# EAGLE design bmx160 (EAGLE 9.6.2)
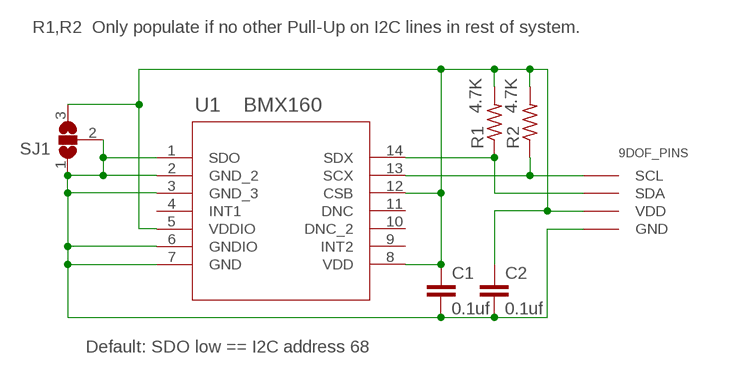
[diagram p0: schematic, sheet 1]

## Parts
C1  0.1uf  C-EUC0603K  [C0603K]
C2  0.1uf  C-EUC0603K  [C0603K]
MOD1  9DOF_PINS  [9DOF_PINS]
R1  4.7K  R-US_M0805  [M0805]
R2  4.7K  R-US_M0805  [M0805]
SJ1  SJ2W  [SJ_2]
U1  BMX160  BMX160BMX160_BOS-M  [BMX160_BOS-M]

## Nets
GND: C1.2 C2.2 MOD1.GND SJ1.1 SJ1.2 U1.1(SDO) U1.2(GND_2) U1.3(GND_3) U1.6(GNDIO) U1.7(GND)
N$3: MOD1.SDA R1.1 U1.14(SDX)
N$4: MOD1.SCL R2.1 U1.13(SCX)
VDD: C1.1 C2.1 MOD1.VDD R1.2 R2.2 SJ1.3 U1.5(VDDIO) U1.8(VDD) U1.12(CSB)
Unconnected: U1.4(INT1) U1.9(INT2) U1.10(DNC_2) U1.11(DNC)

## Notes on the sheet
- R1,R2  Only populate if no other Pull-Up on I2C lines in rest of system.
- Default: SDO low == I2C address 68

## Library data of the parts
C1 C2 = rcl:C-EU: CAPACITOR, European symbol; SPICEPREFIX: C
MOD1 = bmx160:9DOF_PINS: Sparkfun part no: SEN-13944, Accel,Rate,Magnetometer
R1 R2 = rcl:R-US_: RESISTOR, American symbol; SPICEPREFIX: R
SJ1 = jumper:SJ2W: SMD solder JUMPER
U1 = bmx160:BMX160; DIGIKEY: 828-1087-1-ND

## Board
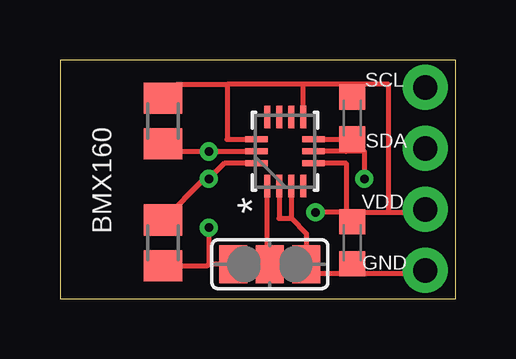
[diagram p1: board, top side]
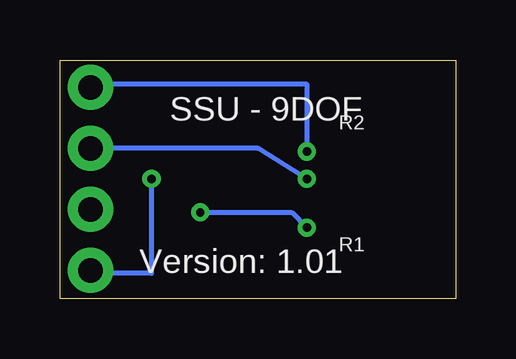
[diagram p2: board, bottom side, seen from below]

Size 16.49 x 9.96 mm. Coordinates in mm from the lower left corner, seen from the top.
Outline: 16.49,9.96 0,9.96 0,0 16.49,0 16.49,9.96
Copper layers (1*16): Top 0.035mm / dielectric 1.5mm / Bottom 0.035mm
Design rules "default *": minimum track width 6mil, minimum drill 0.35mm, track to track 6mil, track to pad 6mil, pad to pad 6mil, via to via 6mil, smd to smd 6mil, copper to edge 10mil, drill to drill 6mil, minimum pad ring 17mil, minimum via ring 8mil, stop-mask expansion 4mil, vias tented up to drill 0mil, thermal gap 10mil

### Footprints (pad centres in the part's own frame; a part is rotated, then mirrored left to right if it is on the bottom)
C0603K = smd 1.05 x 1.08: 1 -0.875,0; 2 0.875,0
9DOF_PINS = drill 1.016 pad 1.676: GND 0,3.81; SCL 0,-3.81; SDA 0,-1.27; VDD 0,1.27
M0805 = smd 1.3 x 1.6: 1 -0.95,0; 2 0.95,0
SJ_2 = smd 1.168 x 1.6: 1 -1.524,0; 2 0,0; 3 1.524,0
BMX160_BOS-M = smd 0.933 x 0.255: 1 -1.433,0.75; 2 -1.433,0.25; 3 -1.433,-0.25; 4 -1.433,-0.75; 8 1.433,-0.75; 9 1.433,-0.25; 10 1.433,0.25; 11 1.433,0.75 | smd 0.255 x 0.933: 5 -0.5,-1.183; 6 0,-1.183; 7 0.5,-1.183; 12 0.5,1.183; 13 0,1.183; 14 -0.5,1.183

### Placement (x,y rotation side)
C1  12.17,7.54 270 top
C2  12.17,2.34 270 top
MOD1  15.22,5 180 top
R1  4.3,2.34 270 top
R2  4.3,7.42 90 top
SJ1  8.74,1.45 180 top
U1  9.38,6.15 90 top

### Tracks (layer width: path | path; a pad name or v marks a point on that pad's centre or on a via)
GND  (via drill 0.35)
  Top 0.152: SJ1.2 SJ1.1
  Top 0.203: SJ1.2 8.63,1.56 U1.1 | U1.3 9.63,3.36 | 9.63,3.36 10.27,2.72 SJ1.1 10.65,1.07 12.17,1.07 | 11.92,6.15 12.68,6.15 v12.68,5 | 11.92,6.15 U1.6 | U1.7 12.15,6.65 C1.2 11.94,6.67 11.92,6.65 11.92,6.15 | 12.17,1.07 15.09,1.07 MOD1.GND | C2.2 12.17,1.07 | 9.63,3.36 9.13,3.36 U1.2
  Bottom 0.203: MOD1.GND 15.22,1.07 12.68,1.07 v12.68,5
N$3  (via drill 0.35)
  Top 0.203: R1.1 6.02,5 v6.2,5 6.85,5.65 U1.14
  Bottom 0.203: v6.2,5 8.23,6.27 MOD1.SDA
N$4  (via drill 0.35)
  Top 0.203: U1.13 v6.2,6.15 4.62,6.15 R2.1
  Bottom 0.203: MOD1.SCL 15.09,8.94 6.2,8.94 v6.2,6.15
VDD  (via drill 0.35)
  Top 0.203: MOD1.VDD 15.22,3.61 13.7,3.61 | 11.92,3.61 11.92,5.65 U1.5 | U1.8 10.13,8.94 | 13.7,3.61 13.7,8.94 12.17,8.94 | 10.13,8.94 6.96,8.94 | U1.12 6.96,6.65 6.96,8.94 | SJ1.3 6.2,1.45 | C2.1 12.17,3.61 | 11.92,3.61 12.17,3.61 | 12.17,3.61 13.7,3.61 | 11.92,3.61 v10.65,3.61 | v6.2,2.97 6.2,1.45 | R1.2 6.14,1.39 6.2,1.45 | R2.2 4.87,8.94 6.96,8.94 | 12.17,8.94 10.13,8.94 | C1.1 12.17,8.94
  Bottom 0.203: v10.65,3.61 6.84,3.61 v6.2,2.97

### Text on the board
tNames: BMX160
bNames: SSU - 9DOF | Version: 1.01
tValues: 68 | 69